# Altium schematic sheet ETH_PHY_SFP.SchDoc
size 420 x 297 mm; DrawnBy: A.B.; Organization: Wydział Elektroniki i Technik Informacyjnych; Address1: ul. Nowowiejska 15/19; Address2: 00-665 Warszawa; Address3: NSW; Address4: Polska; Revision: 0; SheetNumber: 3; SheetTotal: 5; CreateDate: 20/06/2024; Designer: A.B.; Projet: Spec7; CheckedDate: -; ModifiedBy: -
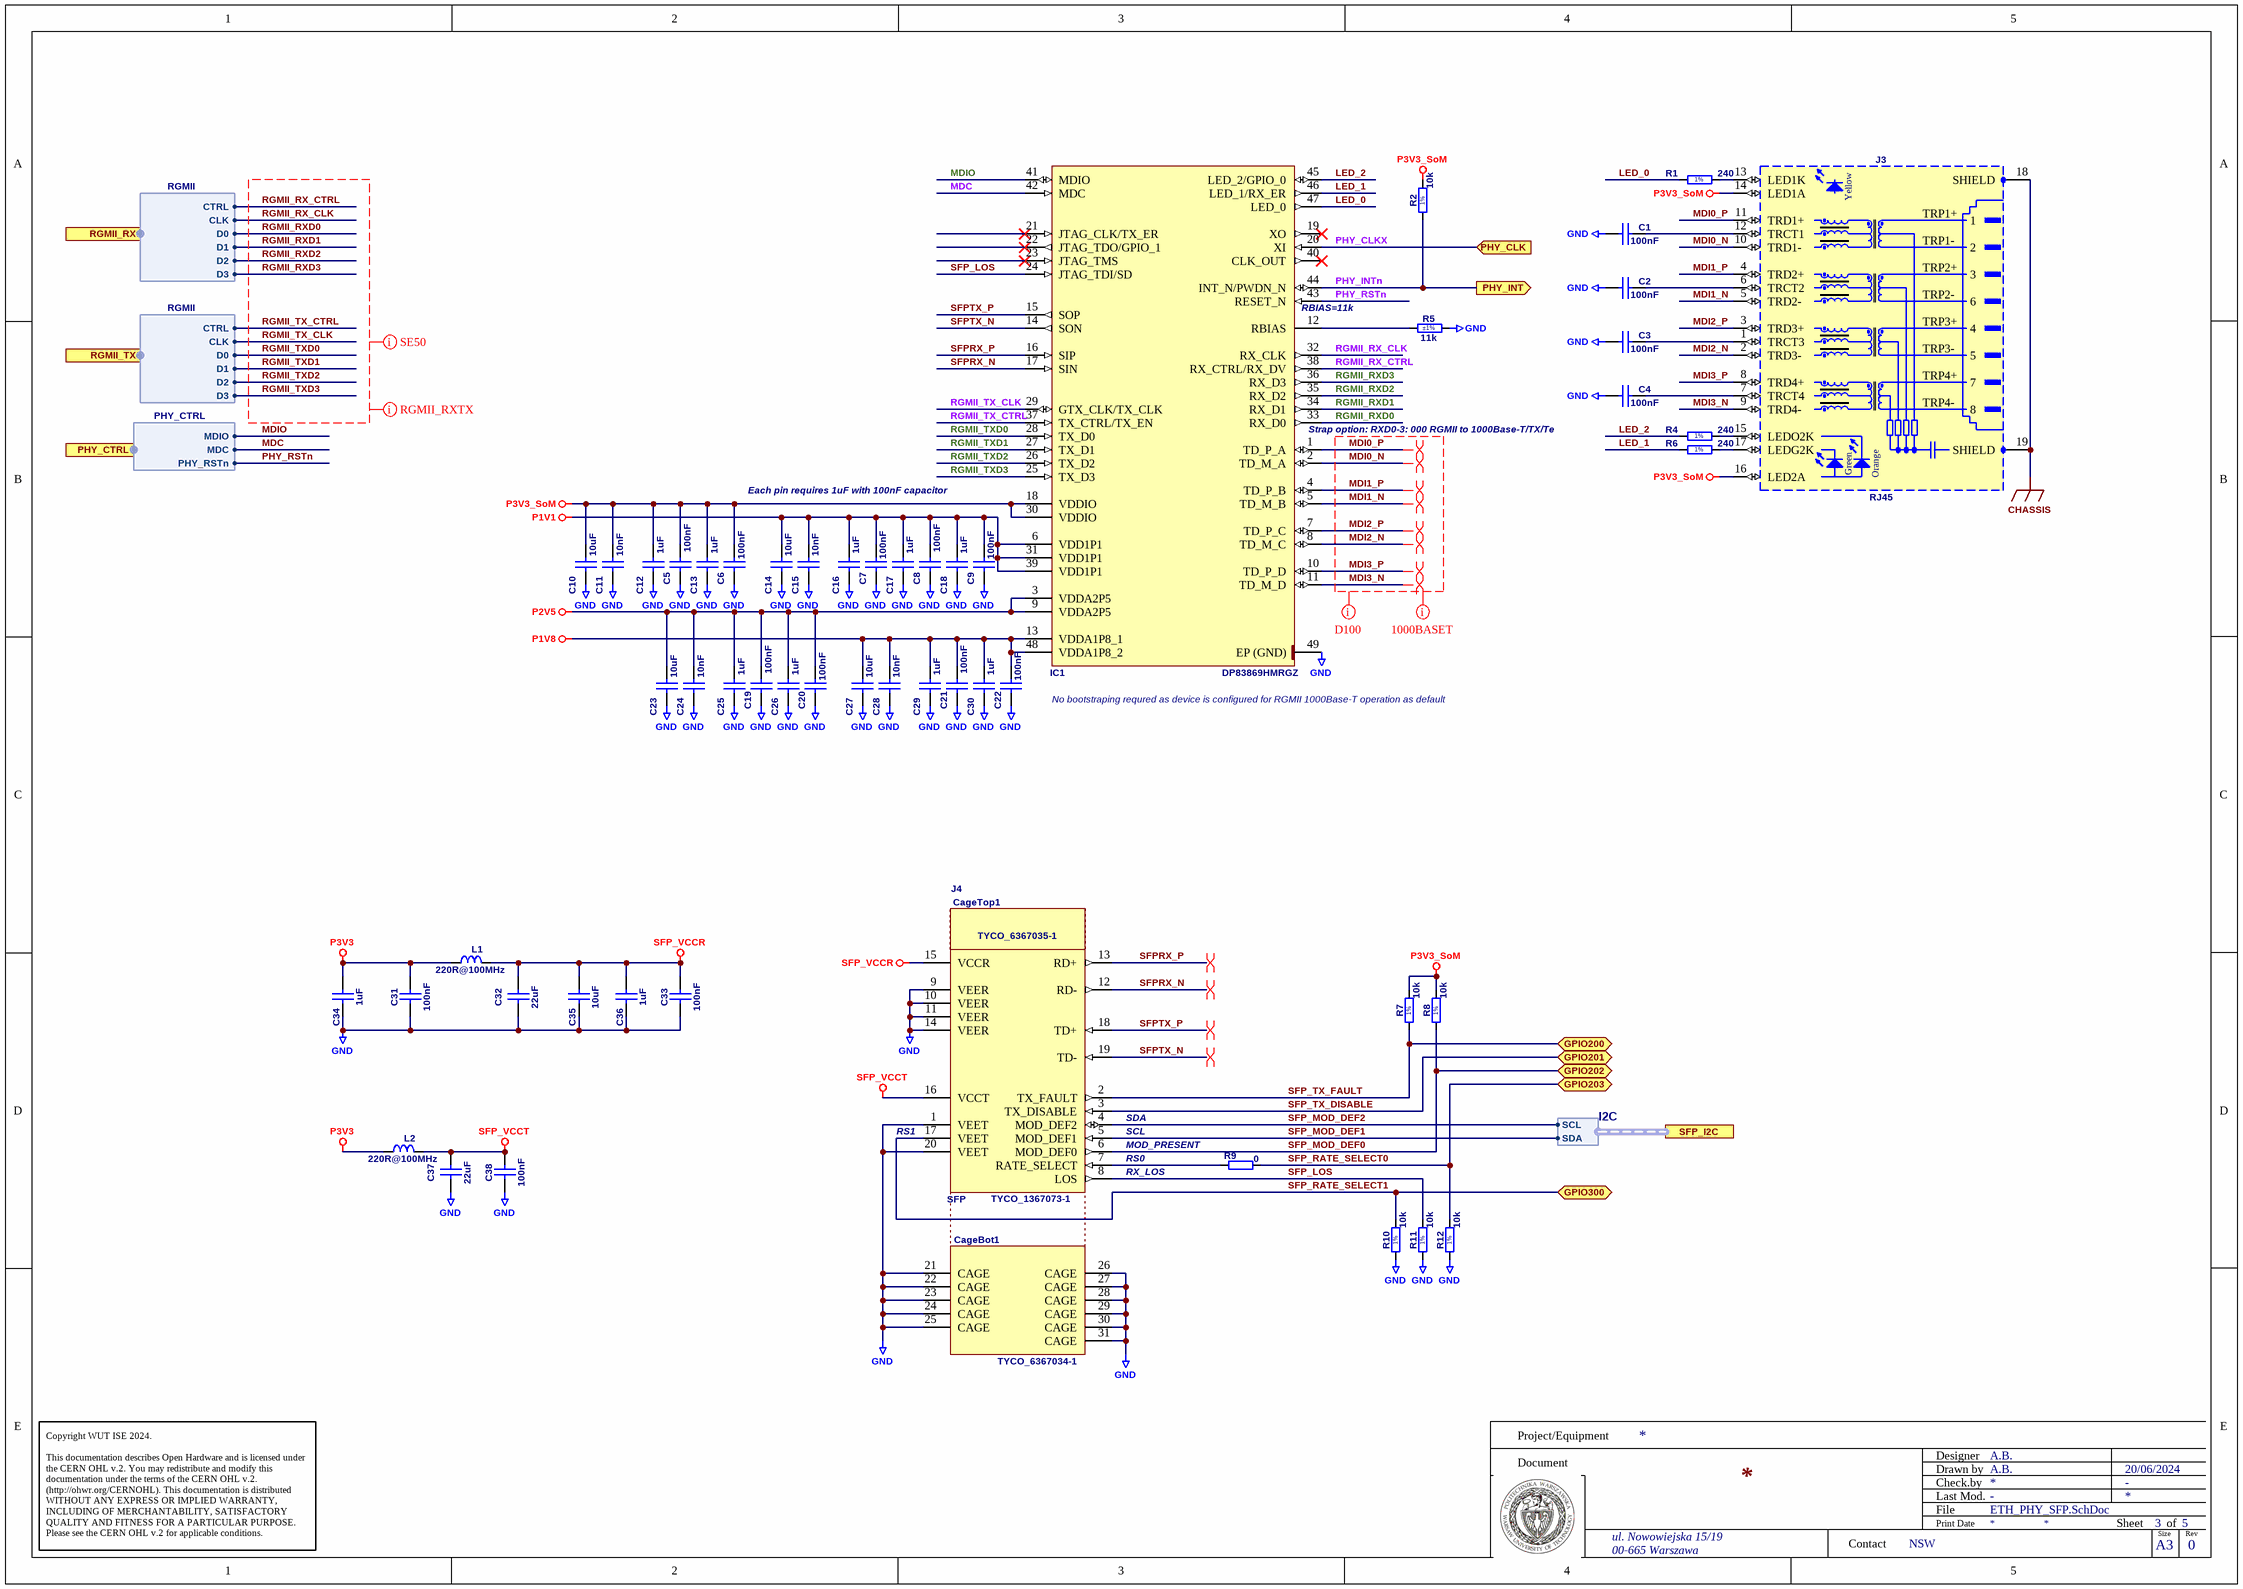
[diagram p0: ETH_PHY_SFP.SchDoc]

## Parts
C1  100nF  [CAPC1005X55N]
C2  100nF  [CAPC1005X55N]
C3  100nF  [CAPC1005X55N]
C4  100nF  [CAPC1005X55N]
C5  100nF  [CAPC1005X55N]
C6  100nF  [CAPC1005X55N]
C7  100nF  [CAPC1005X55N]
C8  100nF  [CAPC1005X55N]
C9  100nF  [CAPC1005X55N]
C10  10uF  [CAPC1608X80N]
C11  10nF  [CAPC1005X55N]
C12  1uF  [CAPC1005X55N]
C13  1uF  [CAPC1005X55N]
C14  10uF  [CAPC1608X80N]
C15  10nF  [CAPC1005X55N]
C16  1uF  [CAPC1005X55N]
C17  1uF  [CAPC1005X55N]
C18  1uF  [CAPC1005X55N]
C19  100nF  [CAPC1005X55N]
C20  100nF  [CAPC1005X55N]
C21  100nF  [CAPC1005X55N]
C22  100nF  [CAPC1005X55N]
C23  10uF  [CAPC1608X80N]
C24  10nF  [CAPC1005X55N]
C25  1uF  [CAPC1005X55N]
C26  1uF  [CAPC1005X55N]
C27  10uF  [CAPC1608X80N]
C28  10nF  [CAPC1005X55N]
C29  1uF  [CAPC1005X55N]
C30  1uF  [CAPC1005X55N]
C31  100nF  [CAPC1005X55N]
C32  22uF  [CAPC2012X135N]
C33  100nF  [CAPC1005X55N]
C34  1uF  [CAPC1005X55N]
C35  10uF  [CAPC1608X80N]
C36  1uF  [CAPC1005X55N]
C37  22uF  [CAPC2012X135N]
C38  100nF  [CAPC1005X55N]
CageBot1  SFP  [TYCO_6367034-1]
CageTop1  SFP  [TYCO_6367035-1]
IC1  DP83869HMRGZ  [QFN50P700X700X100-49N-S420]
J3  RJ45  [BEL_L829-1J1T-43]
J4  SFP  [TYCO_1367073-1]
L1  220R@100MHz  [INDC2012X105N]
L2  220R@100MHz  [INDC2012X105N]
R1  240  [RESC1005X40N]
R2  10k  [RESC1005X40N]
R4  240  [RESC1005X40N]
R5  11k  Tolerance: ±1%  [RESC1005X40N]
R6  240  [RESC1005X40N]
R7  10k  [RESC1005X40N]
R8  10k  [RESC1005X40N]
R9  0  [RESC1005X40N]
R10  10k  [RESC1005X40N]
R11  10k  [RESC1005X40N]
R12  10k  [RESC1005X40N]

## Ports
GPIO200 (bidir), GPIO201 (bidir), GPIO202 (bidir), GPIO203 (bidir), GPIO300 (bidir), PHY_CLK (in), PHY_CTRL (harness PHY_CTRL), PHY_INT (out), RGMII_RX (harness RGMII), RGMII_TX (harness RGMII), SFP_I2C (harness I2C)

## Harnesses
RGMII: CTRL, CLK, D0, D1, D2, D3
PHY_CTRL: MDIO, MDC, PHY_RSTn
I2C: SCL, SDA

## Nets
CHASSIS: J3.18(SHIELD) J3.19(SHIELD)
GND: C1.1 C2.1 C3.1 C4.1 C5.1 C6.1 C7.1 C8.1 C9.1 C10.1 C11.1 C12.1 C13.1 C14.1 C15.1 C16.1 C17.1 C18.1 C19.1 C20.1 C21.1 C22.1 C23.1 C24.1 C25.1 C26.1 C27.1 C28.1 C29.1 C30.1 C31.1 C32.1 C33.1 C34.1 C35.1 C36.1 C37.1 C38.1 CageBot1.21(CAGE) CageBot1.22(CAGE) CageBot1.23(CAGE) CageBot1.24(CAGE) CageBot1.25(CAGE) CageBot1.26(CAGE) CageBot1.27(CAGE) CageBot1.28(CAGE) CageBot1.29(CAGE) CageBot1.30(CAGE) CageBot1.31(CAGE) IC1.49(EP_(GND)) J4.1(VEET) J4.9(VEER) J4.10(VEER) J4.11(VEER) J4.14(VEER) J4.20(VEET) R5.2 R10.1 R11.1 R12.1
P1V1: C7.2 C8.2 C9.2 C14.2 C15.2 C16.2 C17.2 C18.2 IC1.6(VDD1P1) IC1.31(VDD1P1) IC1.39(VDD1P1)
P1V8: C21.2 C22.2 C27.2 C28.2 C29.2 C30.2 IC1.13(VDDA1P8_1) IC1.48(VDDA1P8_2)
P2V5: C19.2 C20.2 C23.2 C24.2 C25.2 C26.2 IC1.3(VDDA2P5) IC1.9(VDDA2P5)
P3V3: C31.2 C34.2 L1.1 L2.1
P3V3_SoM: C5.2 C6.2 C10.2 C11.2 C12.2 C13.2 IC1.18(VDDIO) IC1.30(VDDIO) J3.14(LED1A) J3.16(LED2A) R2.2 R7.2 R8.2
SFP_VCCR: C32.2 C33.2 C35.2 C36.2 J4.15(VCCR) L1.2
SFP_VCCT: C37.2 C38.2 J4.16(VCCT) L2.2
LED_0: IC1.47(LED_0) R1.1
LED_1: IC1.46(LED_1/RX_ER) R6.1
LED_2: IC1.45(LED_2/GPIO_0) R4.1
MDC: IC1.42(MDC) ; port PHY_CTRL.MDC
MDI0_N: IC1.2(TD_M_A) J3.10(TRD1-)
MDI0_P: IC1.1(TD_P_A) J3.11(TRD1+)
MDI1_N: IC1.5(TD_M_B) J3.5(TRD2-)
MDI1_P: IC1.4(TD_P_B) J3.4(TRD2+)
MDI2_N: IC1.8(TD_M_C) J3.2(TRD3-)
MDI2_P: IC1.7(TD_P_C) J3.3(TRD3+)
MDI3_N: IC1.11(TD_M_D) J3.9(TRD4-)
MDI3_P: IC1.10(TD_P_D) J3.8(TRD4+)
MDIO: IC1.41(MDIO) ; port PHY_CTRL.MDIO
PHY_CLKX: IC1.20(XI) ; port PHY_CLK
PHY_INTn: IC1.44(INT_N/PWDN_N) R2.1 ; port PHY_INT
PHY_RSTn: IC1.43(RESET_N) ; port PHY_CTRL.PHY_RSTn
RGMII_RX_CLK: IC1.32(RX_CLK) ; port RGMII_RX.CLK
RGMII_RX_CTRL: IC1.38(RX_CTRL/RX_DV) ; port RGMII_RX.CTRL
RGMII_RXD0: IC1.33(RX_D0) ; port RGMII_RX.D0
RGMII_RXD1: IC1.34(RX_D1) ; port RGMII_RX.D1
RGMII_RXD2: IC1.35(RX_D2) ; port RGMII_RX.D2
RGMII_RXD3: IC1.36(RX_D3) ; port RGMII_RX.D3
RGMII_TX_CLK: IC1.29(GTX_CLK/TX_CLK) ; port RGMII_TX.CLK
RGMII_TX_CTRL: IC1.37(TX_CTRL/TX_EN) ; port RGMII_TX.CTRL
RGMII_TXD0: IC1.28(TX_D0) ; port RGMII_TX.D0
RGMII_TXD1: IC1.27(TX_D1) ; port RGMII_TX.D1
RGMII_TXD2: IC1.26(TX_D2) ; port RGMII_TX.D2
RGMII_TXD3: IC1.25(TX_D3) ; port RGMII_TX.D3
SFP_LOS: IC1.24(JTAG_TDI/SD) J4.8(LOS) R11.2
SFP_MOD_DEF0: J4.6(MOD_DEF0) R8.1 ; port GPIO202
SFP_MOD_DEF1: J4.5(MOD_DEF1) ; port SFP_I2C.SDA
SFP_MOD_DEF2: J4.4(MOD_DEF2) ; port SFP_I2C.SCL
SFP_RATE_SELECT0: R9.2 R12.2 ; port GPIO203
SFP_RATE_SELECT1: J4.17(VEET) R10.2 ; port GPIO300
SFP_TX_DISABLE: J4.3(TX_DISABLE) ; port GPIO201
SFP_TX_FAULT: J4.2(TX_FAULT) R7.1 ; port GPIO200
SFPRX_N: IC1.17(SIN) J4.12(RD-)
SFPRX_P: IC1.16(SIP) J4.13(RD+)
SFPTX_N: IC1.14(SON) J4.19(TD-)
SFPTX_P: IC1.15(SOP) J4.18(TD+)
NetC1_2: C1.2 J3.12(TRCT1)
NetC2_2: C2.2 J3.6(TRCT2)
NetC3_2: C3.2 J3.1(TRCT3)
NetC4_2: C4.2 J3.7(TRCT4)
NetIC1_12: IC1.12(RBIAS) R5.1
NetJ3_13: J3.13(LED1K) R1.2
NetJ3_15: J3.15(LEDO2K) R4.2
NetJ3_17: J3.17(LEDG2K) R6.2
NetJ4_7: J4.7(RATE_SELECT) R9.1

Not connected (* = marked no-connect by the designer): IC1 19(XO)* 21(JTAG_CLK/TX_ER)* 22(JTAG_TDO/GPIO_1)* 23(JTAG_TMS)* 40(CLK_OUT)*

## Layout directives
net class RGMII_RXTX: RGMII_RX_CLK, RGMII_RX_CTRL, RGMII_RXD0, RGMII_RXD1, RGMII_RXD2, RGMII_RXD3, RGMII_TX_CLK, RGMII_TX_CTRL, RGMII_TXD0, RGMII_TXD1, RGMII_TXD2, RGMII_TXD3
net class SE50: RGMII_RX_CLK, RGMII_RX_CTRL, RGMII_RXD0, RGMII_RXD1, RGMII_RXD2, RGMII_RXD3, RGMII_TX_CLK, RGMII_TX_CTRL, RGMII_TXD0, RGMII_TXD1, RGMII_TXD2, RGMII_TXD3
differential pair: MDI0_N, MDI0_P, MDI1_N, MDI1_P, MDI2_N, MDI2_P, MDI3_N, MDI3_P, SFPRX_N, SFPRX_P, SFPTX_N, SFPTX_P
net class D100: MDI0_N, MDI0_P, MDI1_N, MDI1_P, MDI2_N, MDI2_P, MDI3_N, MDI3_P
net class 1000BASET: MDI0_N, MDI0_P, MDI1_N, MDI1_P, MDI2_N, MDI2_P, MDI3_N, MDI3_P

## Notes on the sheet
- (near IC1) RBIAS=11k
- (near IC1) Strap option: RXD0-3: 000 RGMII to 1000Base-T/TX/Te
- Each pin requires 1uF with 100nF capacitor
- No bootstraping requred as device is configured for RGMII 1000Base-T operation as default
- (near J4) RS1
- (near J4) SDA
- (near J4) SCL
- MOD_PRESENT
- (near J4) RS0
- (near J4) RX_LOS
- Project/Equipment
- Document
- Designer
- Drawn by
- Check.by
- Copyright WUT ISE 2024.
  This documentation describes Open Hardware and is licensed under the CERN OHL v.2. You may redistribute and modify this documentation under the terms of the CERN OHL v.2. (http://ohwr.org/CERNOHL). This documentation is distributed WITHOUT ANY EXPRESS OR IMPLIED WARRANTY, INCLUDING OF MERCHANTABILITY, SATISFACTORY QUALITY AND FITNESS FOR A PARTICULAR PURPOSE. Please see the CERN OHL v.2 for applicable conditions.
- Contact
- File
- Last Mod.
- Print Date
- Sheet
- Size
- A3
- of
- Rev
- (in symbol BELFUSE_L829-1J1T-43) Yellow; TRP1+; TRP1-; TRP2+; TRP2-; TRP3+; TRP3-; TRP4+; TRP4-; Green; Orange
- (in symbol R0402_10K_1%_0.0625W_100PPM) 1%
- (in symbol R0402_240R_1%_0.0625W_100PPM) 1%
- (in symbol TYCO_1367073-1) Add Cage Top Here; (Ex: TYCO_6367035-1); Add Cage Bottom Here; (Ex: TYCO_6367034-1)

## Library data of the parts
C1-C9 C19-C22 C31 C33 C38 = CC0402_100NF_16V_10%_X7R: Non-polarised capacitor; Part Description: SMD Multilayer Chip Ceramic Capacitor; Manufacturer: GENERIC; Manufacturer1 Part Number: GRM155R71C104KA88D; Voltage: 16V; TC: X7R; Tolerance: ±10%; Part Number: CC0402_100NF_16V_10%_X7R; Component Kind: Standard; Component Type: Standard; Pin Count: 2; Value: 100nF; Status: Not Recommended; Manufacturer Part Number: CC0402_100NF_16V_10%_X7R; Case: 0402; Mounted: Yes; Socket: No; SMD: Yes; Sense: No; Manufacturer1 Example: MURATA; Manufacturer1 ComponentHeight: 0.55mm; HelpURL: \\cern.ch\dfs\Applications\Altium\Datasheets\CC0402_X7R_MURATA_GRM.pdf; Author: CERN DEM JLC; CreateDate: 05/12/2013; LatestRevisionDate: 03/12/2007
C10 C14 C23 C27 C35 = CC0603_10UF_16V_20%_X5R: Non-polarised capacitor; Part Description: SMD Multilayer Chip Ceramic Capacitor; Manufacturer: GENERIC; Manufacturer1 Part Number: GRM188R61C106MA73D; Voltage: 16V; TC: X5R; Tolerance: ±20%; Part Number: CC0603_10UF_16V_20%_X5R; Component Kind: Standard; Component Type: Standard; Pin Count: 2; Value: 10uF; Status: None; Manufacturer Part Number: CC0603_10UF_16V_20%_X5R; Case: 0603; Mounted: Yes; Socket: No; SMD: Yes; Sense: No; Manufacturer1 Example: MURATA; Manufacturer1 ComponentHeight: 0.8mm; HelpURL: \\cern.ch\dfs\Applications\Altium\Datasheets\CC0603_X5R_MURATA_GRM.pdf; Author: CERN DEM MR; CreateDate: 02.03.2016; LatestRevisionDate: 02.03.2016
C11 C15 C24 C28 = CC0402_10NF_16V_10%_X7R: Non-polarised capacitor; Part Description: SMD Multilayer Chip Ceramic Capacitor; Manufacturer: GENERIC; Manufacturer1 Part Number: 223878715636; Voltage: 16V; TC: X7R; Tolerance: ±10%; Part Number: CC0402_10NF_16V_10%_X7R; Component Kind: Standard; Component Type: Standard; Pin Count: 2; Value: 10nF; Status: Not Recommended; Manufacturer Part Number: CC0402_10NF_16V_10%_X7R; Case: 0402; Mounted: Yes; Socket: No; SMD: Yes; Sense: No; Manufacturer1 Example: PHYCOMP; Manufacturer1 ComponentHeight: 0.55mm; HelpURL: \\cern.ch\dfs\Applications\Altium\Datasheets\CC0402_X7R_PHYCOMP.pdf; Author: CERN DEM JLC; CreateDate: 03.12.2007; LatestRevisionDate: 03.12.2007
C12 C13 C16-C18 C25 C26 C29 C30 C34 C36 = CC0402_1UF_16V_10%_X5R: Non-polarised capacitor; Part Description: SMD Multilayer Chip Ceramic Capacitor; Manufacturer: GENERIC; Manufacturer1 Part Number: C1005X5R1C105KT; Voltage: 16V; TC: X5R; Tolerance: ±10%; Part Number: CC0402_1UF_16V_10%_X5R; Component Kind: Standard; Component Type: Standard; Pin Count: 2; Value: 1uF; Status: Preferred; Manufacturer Part Number: CC0402_1UF_16V_10%_X5R; Case: 0402; Mounted: Yes; Socket: No; SMD: Yes; Sense: No; Manufacturer1 Example: TDK; Manufacturer1 ComponentHeight: 0.55mm; HelpURL: \\cern.ch\dfs\Applications\Altium\Datasheets\CC0402_X5R_TDK_C.pdf; Author: CERN DEM JLC; CreateDate: 2012-10-25; LatestRevisionDate: 2012-10-25
C32 C37 = CC0805_22UF_16V_10%_X5R: Non-polarised capacitor; Manufacturer: GENERIC; Part Description: SMD Multilayer Chip Ceramic Capacitor; Manufacturer1 Part Number: C2012X5R1C226KT; Tolerance: ±10%; Voltage: 16V; TC: X5R; Manufacturer Part Number: CC0805_22UF_16V_10%_X5R; Part Number: CC0805_22UF_16V_10%_X5R; Value: 22uF; Component Kind: Standard; Component Type: Standard; Pin Count: 2; Status: Preferred; Case: 0805; Mounted: Yes; Socket: No; SMD: Yes; Sense: No; Manufacturer1 Example: TDK; Manufacturer1 ComponentHeight: 1.35mm; HelpURL: \\cern.ch\dfs\Applications\Altium\Datasheets\CC0805_X5R_TDK_C.pdf; Author: CERN DEM JLC; CreateDate: 25.10.2012; LatestRevisionDate: 25.10.2012
CageBot1 = TYCO_6367034-1: SFP  Cage Bottom (Small Form-factor Pluggable); Part Description: Cage bottom For Single Port SFP  (Small Form-factor Pluggable); Manufacturer: TYCO ELECTRONICS; Table: TYCO; Part Number: TYCO_6367034-1; Component Kind: Standard; Component Type: Standard; Pin Count: 11; Family: SFP; Mounted: Yes; Socket: No; SMD: No; Status: None; Manufacturer Part Number: TYCO_6367034-1; ComponentHeight: 8.8mm; ComponentLink1URL: \\cern.ch\dfs\Applications\Altium\Datasheets\TYCO_SFP_Application.pdf; ComponentLink1Description: Application; ComponentLink2URL: \\cern.ch\dfs\Applications\Altium\Datasheets\Tyco_SFP_Specification.pdf; ComponentLink2Description: SFP Specification; HelpURL: \\cern.ch\dfs\Applications\Altium\Datasheets\TYCO_6367034-1.pdf; Author: CERN DEM JLC; CreateDate: 25.01.2010; LatestRevisionDate: 25.01.2010; ClassName: Component_Not_DRC
CageTop1 = TYCO_6367035-1: SFP  Cage Top (Small Form-factor Pluggable); Part Description: Cage Top For Single Port SFP  (Small Form-factor Pluggable); Manufacturer: TYCO ELECTRONICS; Table: TYCO; Part Number: TYCO_6367035-1; Component Kind: Standard; Component Type: Standard; Designator: SFPx1_Cage Top; Library Reference: SFPx1_Cage Top; Pin Count: 0; Family: SFP; Mounted: Yes; Socket: No; SMD: No; Status: None; Manufacturer Part Number: TYCO_6367035-1; ComponentHeight: 10mm; Datasheet: \\cern.ch\dfs\Applications\Altium\Datasheets\TYCO_6367035-1.pdf; ComponentLink1URL: \\cern.ch\dfs\Applications\Altium\Datasheets\TYCO_SFP_Application.pdf; ComponentLink1Description: Application; ComponentLink2URL: \\cern.ch\dfs\Applications\Altium\Datasheets\Tyco_SFP_Specification.pdf; ComponentLink2Description: SFP Specification; HelpURL: \\cern.ch\dfs\Applications\Altium\Datasheets\TYCO_6367035-1.pdf; Author: CERN DEM JLC; CreateDate: 25/01/2010; LatestRevisionDate: 25/01/2010; ClassName: Component_Not_DRC
IC1 = DP83869HMRGZ: DP83869HM High Immunity 10/100/1000 Ethernet Physical Layer Transceiver WithCopper and Fiber Interface; Manufacturer: TEXAS INSTRUMENTS; PressFit: No; Bonding: No; Part Number: DP83869HMRGZ; Component Kind: Standard; Component Type: Standard; Device: DP83869HMRGZ; PackageDescription: QFN, 0.50mm Pitch, Square; 48 Pin, 7.00mm L X 7.00mm W X 1.00mm H body (w/Thermal Tab 4.20 X 4.20mm), IPC Medium Density; Part Description: High Immunity 10/100/1000 Ethernet Physical Layer Transceiver with Copper and Fiber Interface; Manufacturer Part Number: DP83869HMRGZ; Pin Count: 48; Case: QFN48; Mounted: Yes; Socket: No; SMD: Yes; Sense: No; ComponentHeight: 1mm; Author: CERN DEM HF; HelpURL: \\cern.ch\dfs\Applications\Altium\Datasheets\DP83869HMRGZ.pdf; CreateDate: 24.04.2024; LatestRevisionDate: 24.04.2024
J3 = BELFUSE_L829-1J1T-43: 1 Port, RJ45, Gigabit Ethernet, MagJack Connector Module With Yellow And Green/Orange LEDs; Part Description: 1 Port, Yellow/ Green-Orange LEDs,  RJ45 10/100/1000 Gigabit Ethernet, MagJack® Connector Module; Manufacturer: BEL MAGNETIC SOLUTIONS; PressFit: No; Part Number: BELFUSE_L829-1J1T-43; Component Kind: Standard; Component Type: Standard; Pin Count: 19; Family: RJ45; Mounted: Yes; Socket: No; SMD: No; Sense: No; Status: None; Manufacturer Part Number: L829-1J1T-43; ComponentHeight: 13.3mm; HelpURL: \\cern.ch\dfs\Applications\Altium\Datasheets\BEL_L829-1J1T-43.pdf; Author: CERN DEM JLC; CreateDate: 22.08.2011; LatestRevisionDate: 20.09.2018
J4 = TYCO_1367073-1: 20 Position SFP  Connector (Small Form-factor Pluggable); Part Description: 20 Position, Pitch 0.8mm SFP  Receptacle (Small Form-factor Pluggable); Manufacturer: TYCO ELECTRONICS; Table: TYCO; Part Number: TYCO_1367073-1; Component Kind: Standard; Component Type: Standard; Pin Count: 20; Family: SFP; Mounted: Yes; Socket: No; SMD: Yes; Status: None; Manufacturer Part Number: 1367073-1; ComponentHeight: 5.4mm; ComponentLink1URL: \\cern.ch\dfs\Applications\Altium\Datasheets\TYCO_SFP_Application.pdf; ComponentLink1Description: Application; ComponentLink2URL: \\cern.ch\dfs\Applications\Altium\Datasheets\Tyco_SFP_Specification.pdf; ComponentLink2Description: SFP Specification; HelpURL: \\cern.ch\dfs\Applications\Altium\Datasheets\TYCO_1367073-1.pdf; Author: CERN DEM JLC; CreateDate: 25/01/2010; LatestRevisionDate: 25/01/2010
L1 L2 = IND0805_MURATA_BLM21PG221SN1D: Inductor; Part Description: SMD EMIFIL Suppression Chip Bead Ferrite; Manufacturer: MURATA; Power: 2A; Resistance: 0.05R; Tolerance: ±25%; Table: Inductors SMD; Part Number: IND0805_MURATA_BLM21PG221SN1D; Component Kind: Standard; Component Type: Standard; Pin Count: 2; Value: 220R@100MHz; Status: None; Manufacturer Part Number: BLM21PG221SN1D; Case: 0805; Mounted: Yes; Socket: No; SMD: Yes; ComponentHeight: 1.05mm; HelpURL: \\cern.ch\dfs\Applications\Altium\Datasheets\IND0402_MURATA_BLM21P.pdf; Author: CERN DEM JLC; CreateDate: 25/01/2010; LatestRevisionDate: 25/01/2010
R1 R4 R6 = R0402_240R_1%_0.0625W_100PPM: Resistor - 1%; Part Description: General Purpose Thick Film Chip Resistor; Manufacturer: GENERIC; Manufacturer1 Part Number: 232270672401L; TC: ±100ppm/°C; PressFit: No; Part Number: R0402_240R_1%_0.0625W_100PPM; Component Kind: Standard; Component Type: Standard; Pin Count: 2; Value: 240; Status: Not Recommended; Power: 0.0625W; Tolerance: ±1%; Manufacturer Part Number: R0402_240R_1%_0.0625W_100PPM; Case: 0402; Mounted: Yes; Sense: No; Socket: No; SMD: Yes; Manufacturer1 Example: YAGEO PHYCOMP; Manufacturer1 ComponentHeight: 0.4mm; HelpURL: \\cern.ch\dfs\Applications\Altium\Datasheets\R0402_Phycomp_RC0402.pdf; Author: CERN DEM JLC; CreateDate: 03.12.2007; LatestRevisionDate: 17.10.2012
R2 R7 R8 R10-R12 = R0402_10K_1%_0.0625W_100PPM: Resistor - 1%; Part Description: General Purpose Thick Film Chip Resistor; Manufacturer: GENERIC; Manufacturer1 Part Number: 232270671003L; TC: ±100ppm/°C; PressFit: No; Part Number: R0402_10K_1%_0.0625W_100PPM; Component Kind: Standard; Component Type: Standard; Pin Count: 2; Value: 10k; Status: Not Recommended; Power: 0.0625W; Tolerance: ±1%; Manufacturer Part Number: R0402_10K_1%_0.0625W_100PPM; Case: 0402; Mounted: Yes; Sense: No; Socket: No; SMD: Yes; Manufacturer1 Example: YAGEO PHYCOMP; Manufacturer1 ComponentHeight: 0.4mm; HelpURL: \\cern.ch\dfs\Applications\Altium\Datasheets\R0402_Phycomp_RC0402.pdf; Author: CERN DEM JLC; CreateDate: 03.12.2007; LatestRevisionDate: 17.10.2012
R5 = R0402_11K_1%_0.0625W_100PPM: Resistor - 1%; Part Description: General Purpose Thick Film Chip Resistor; Manufacturer: GENERIC; Manufacturer1 Part Number: 232270671103L; TC: ±100ppm/°C; PressFit: No; Part Number: R0402_11K_1%_0.0625W_100PPM; Component Kind: Standard; Component Type: Standard; Pin Count: 2; Value: 11k; Status: Not Recommended; Power: 0.0625W; Manufacturer Part Number: R0402_11K_1%_0.0625W_100PPM; Case: 0402; Mounted: Yes; Sense: No; Socket: No; SMD: Yes; Manufacturer1 Example: YAGEO PHYCOMP; Manufacturer1 ComponentHeight: 0.4mm; HelpURL: \\cern.ch\dfs\Applications\Altium\Datasheets\R0402_Phycomp_RC0402.pdf; Author: CERN DEM JLC; CreateDate: 03.12.2007; LatestRevisionDate: 17.10.2012
R9 = R0402_0R_JUMPER: Resistor; Part Description: 1A (0.05R Max DC Resistance) Zero Ohm Jumper; Manufacturer: GENERIC; Manufacturer1 Part Number: 232270591001L; PressFit: No; Part Number: R0402_0R_JUMPER; Component Kind: Standard; Component Type: Standard; Pin Count: 2; Value: 0; Status: Not Recommended; Manufacturer Part Number: R0402_0R_JUMPER; Case: 0402; Mounted: Yes; Sense: No; Socket: No; SMD: Yes; Manufacturer1 Example: YAGEO PHYCOMP; Manufacturer1 ComponentHeight: 0.4mm; HelpURL: \\cern.ch\dfs\Applications\Altium\Datasheets\R0402_Phycomp_RC0402.pdf; Author: CERN DEM JLC; CreateDate: 03.12.2007; LatestRevisionDate: 17.10.2012